# EAGLE design cv-strip (EAGLE 6.6.0)
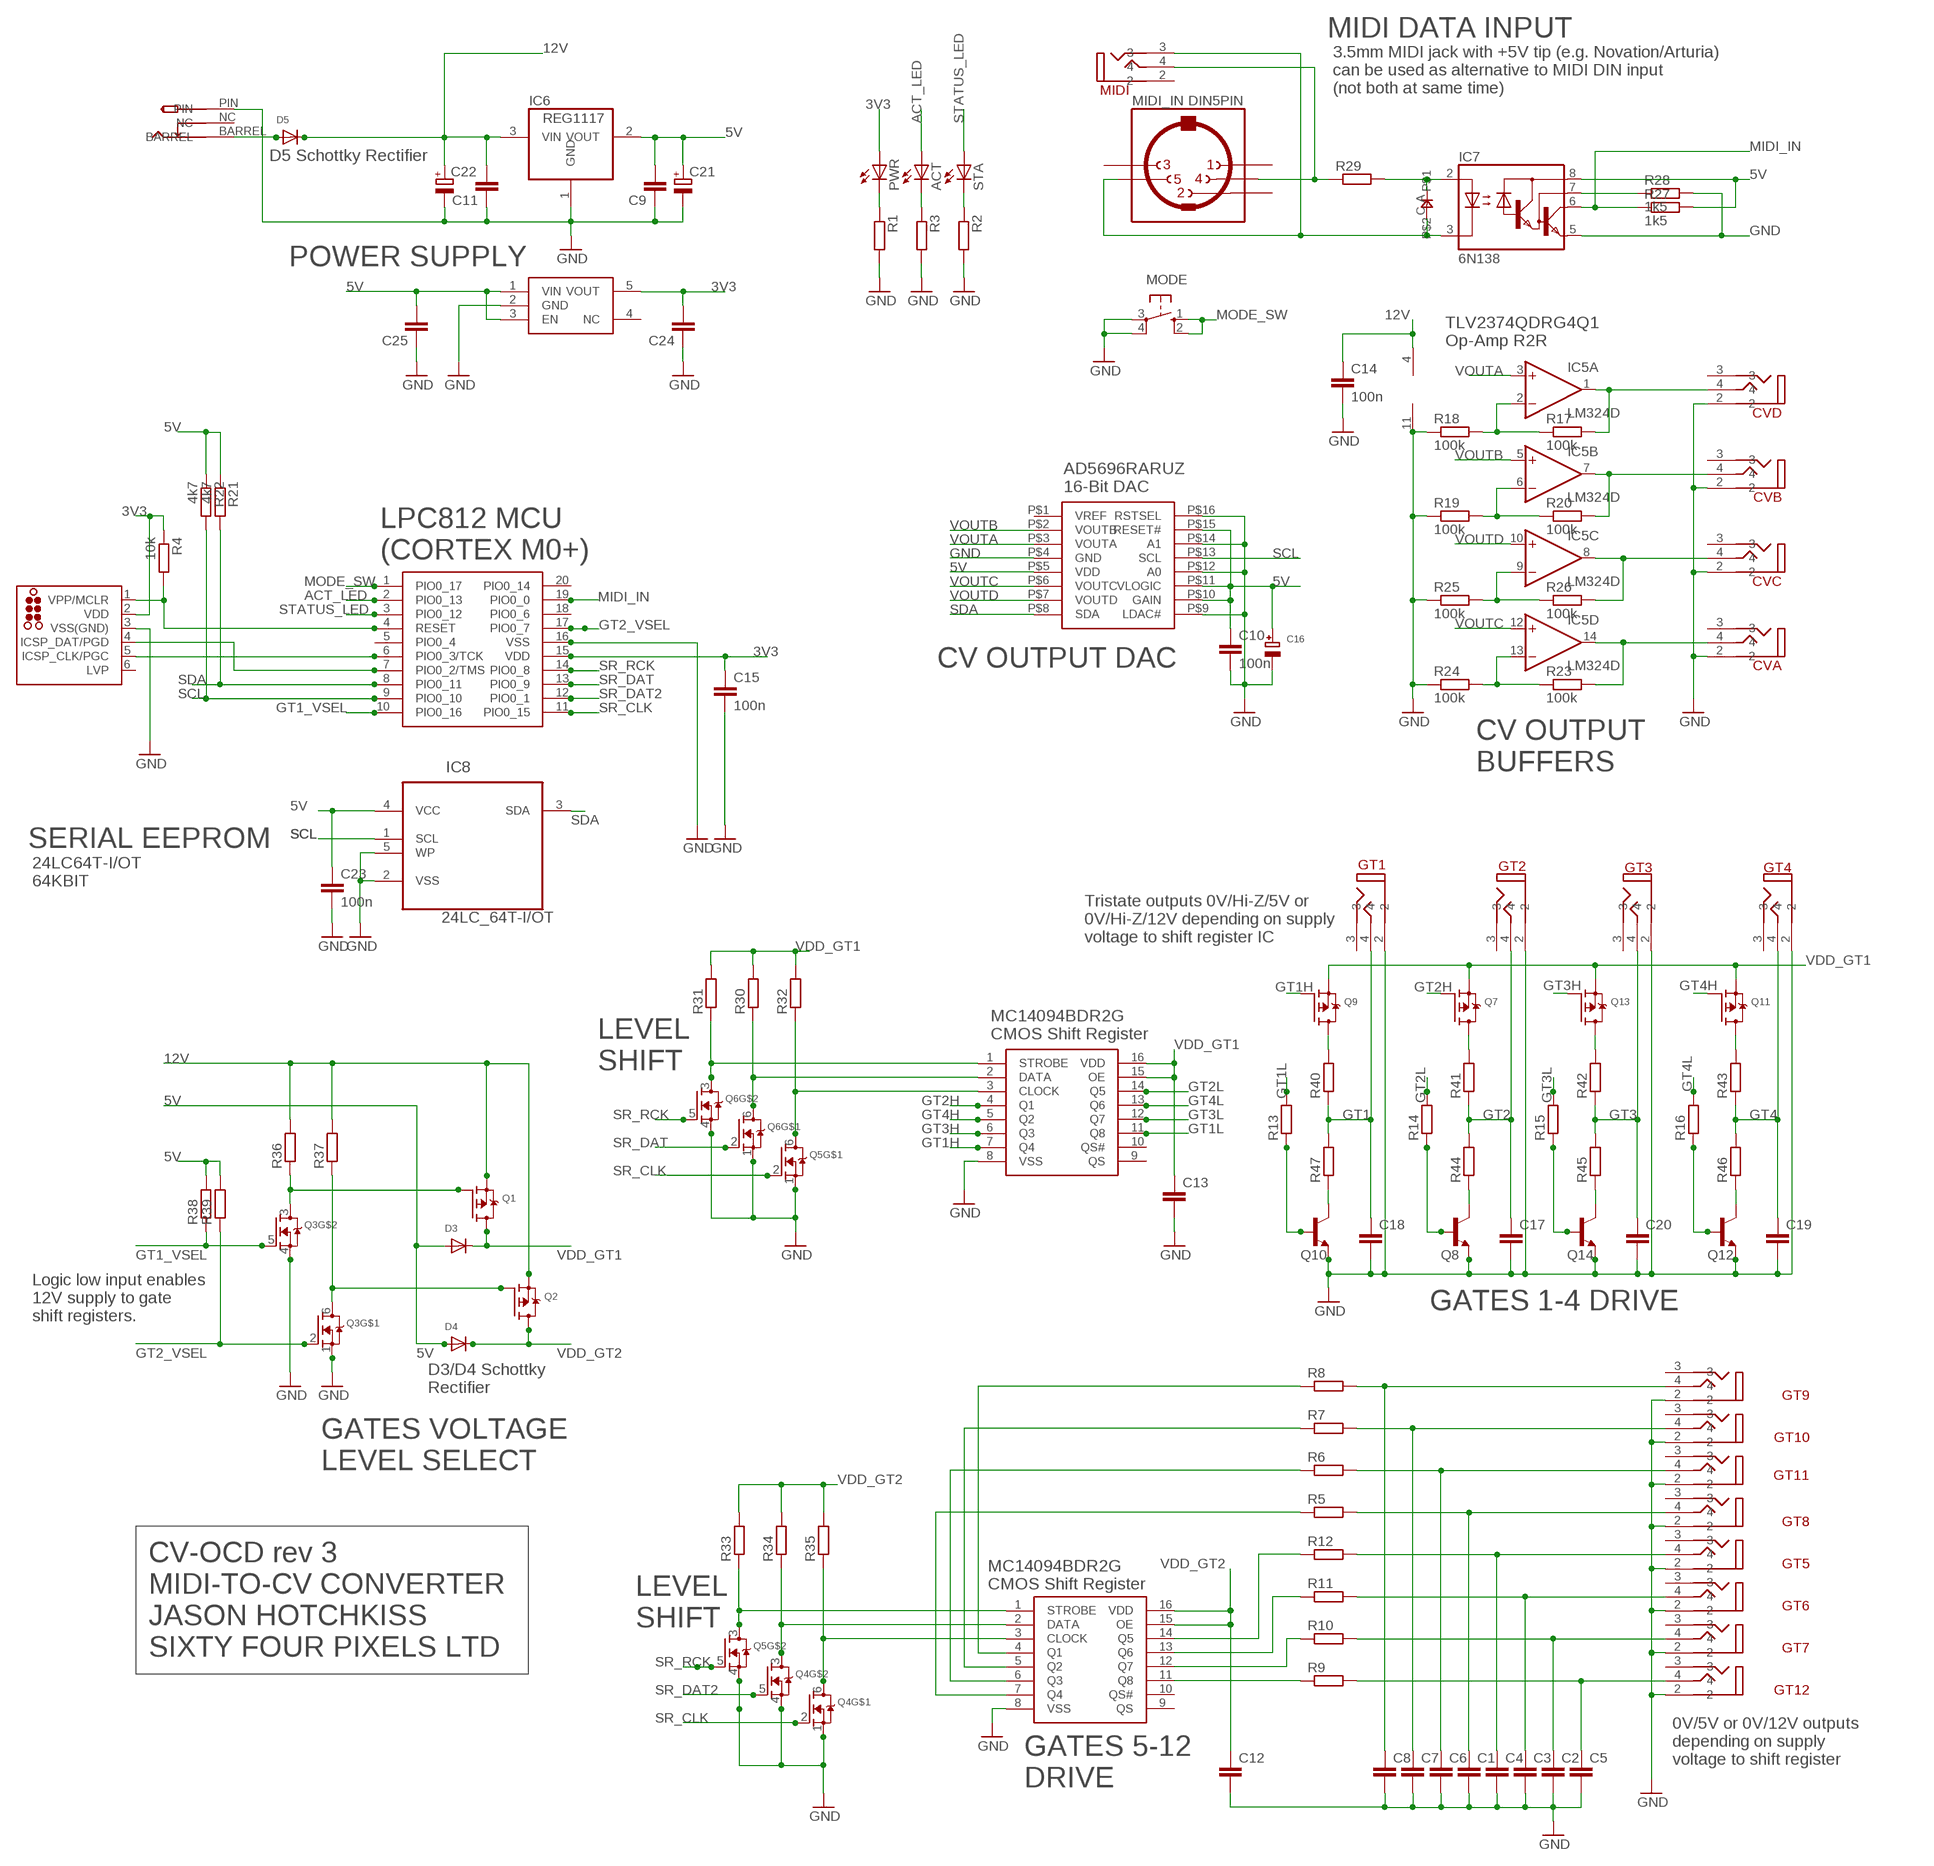
[diagram p0: schematic, sheet 1]

## Parts
ACT  LED3MM  [LED3MM]
C1  C-EUC0805  [C0805]
C2  C-EUC0805  [C0805]
C3  C-EUC0805  [C0805]
C4  C-EUC0805  [C0805]
C5  C-EUC0805  [C0805]
C6  C-EUC0805  [C0805]
C7  C-EUC0805  [C0805]
C8  C-EUC0805  [C0805]
C9  C-EUC0805  [C0805]
C10  100n  C-EUC0805  [C0805]
C11  C-EUC0805  [C0805]
C12  C-EUC0805  [C0805]
C13  C-EUC0805  [C0805]
C14  100n  C-EUC0805  [C0805]
C15  100n  C-EUC0805  [C0805]
C16  CAP_TANTALUMA/3216_REFLOW  [EIA3216-18/A-R]
C17  C-EUC0805  [C0805]
C18  C-EUC0805  [C0805]
C19  C-EUC0805  [C0805]
C20  C-EUC0805  [C0805]
C21  CPOL-EUE2.5-5  [E2,5-5]
C22  CPOL-EUE2.5-5  [E2,5-5]
C23  100n  C-EUC0805  [C0805]
C24  C-EUC0805  [C0805]
C25  C-EUC0805  [C0805]
CVA  VERTICAL_3_5MM_SOCKET  [VERTICAL_3_5MM_SOCKET]
CVB  VERTICAL_3_5MM_SOCKET  [VERTICAL_3_5MM_SOCKET]
CVC  VERTICAL_3_5MM_SOCKET  [VERTICAL_3_5MM_SOCKET]
CVD  VERTICAL_3_5MM_SOCKET  [VERTICAL_3_5MM_SOCKET]
D1  0805DIODE  [0805DIODE]
D3  DIODESOD-123  [SOD-123]
D4  DIODESOD-123  [SOD-123]
D5  DIODESOD-123  [SOD-123]
GT1  VERTICAL_3_5MM_SOCKET  [VERTICAL_3_5MM_SOCKET]
GT2  VERTICAL_3_5MM_SOCKET  [VERTICAL_3_5MM_SOCKET]
GT3  VERTICAL_3_5MM_SOCKET  [VERTICAL_3_5MM_SOCKET]
GT4  VERTICAL_3_5MM_SOCKET  [VERTICAL_3_5MM_SOCKET]
GT5  VERTICAL_3_5MM_SOCKET  [VERTICAL_3_5MM_SOCKET]
GT6  VERTICAL_3_5MM_SOCKET  [VERTICAL_3_5MM_SOCKET]
GT7  VERTICAL_3_5MM_SOCKET  [VERTICAL_3_5MM_SOCKET]
GT8  VERTICAL_3_5MM_SOCKET  [VERTICAL_3_5MM_SOCKET]
GT9  VERTICAL_3_5MM_SOCKET  [VERTICAL_3_5MM_SOCKET]
GT10  VERTICAL_3_5MM_SOCKET  [VERTICAL_3_5MM_SOCKET]
GT11  VERTICAL_3_5MM_SOCKET  [VERTICAL_3_5MM_SOCKET]
GT12  VERTICAL_3_5MM_SOCKET  [VERTICAL_3_5MM_SOCKET]
IC1  LPC812  [TSSOP20]
IC2  AD5696R  [SSOP16]
IC3  MC14094B  [SO16]
IC4  MC14094B  [SO16]
IC5  LM324D  [SO14]
IC6  REG1117  [SOT223]
IC7  6N138  [DIL08]
IC8  24LC_64T-I/OT  [SOT95P290X145-5N]
IC9  MIC5504-2.8YM5-TR  [SOT23-5]
ICSP  TC2030-MCP-NL  [TC2030-MCP-NL]
MIDI  VERTICAL_3_5MM_SOCKET  [VERTICAL_3_5MM_SOCKET]
MIDI_IN  DIN5PIN  [EDGEDIN]
MODE  10-XX  [B3F-10XX]
PWR  LED3MM  [LED3MM]
Q1  MOSFET-P  [SOT23-R]
Q2  MOSFET-P  [SOT23-R]
Q3  MOSFET-N_DUAL  [SOT363]
Q4  MOSFET-N_DUAL  [SOT363]
Q5  MOSFET-N_DUAL  [SOT363]
Q6  MOSFET-N_DUAL  [SOT363]
Q7  MOSFET-P  [SOT23-R]
Q8  MMBT3904LT1-NPN-SOT23-BEC  [SOT23-BEC]
Q9  MOSFET-P  [SOT23-R]
Q10  MMBT3904LT1-NPN-SOT23-BEC  [SOT23-BEC]
Q11  MOSFET-P  [SOT23-R]
Q12  MMBT3904LT1-NPN-SOT23-BEC  [SOT23-BEC]
Q13  MOSFET-P  [SOT23-R]
Q14  MMBT3904LT1-NPN-SOT23-BEC  [SOT23-BEC]
R1  R-EU_R0805  [R0805]
R2  R-EU_R0805  [R0805]
R3  R-EU_R0805  [R0805]
R4  10k  R-EU_R0805  [R0805]
R5  R-EU_R0805  [R0805]
R6  R-EU_R0805  [R0805]
R7  R-EU_R0805  [R0805]
R8  R-EU_R0805  [R0805]
R9  R-EU_R0805  [R0805]
R10  R-EU_R0805  [R0805]
R11  R-EU_R0805  [R0805]
R12  R-EU_R0805  [R0805]
R13  R-EU_R0805  [R0805]
R14  R-EU_R0805  [R0805]
R15  R-EU_R0805  [R0805]
R16  R-EU_R0805  [R0805]
R17  100k  R-EU_R0805  [R0805]
R18  100k  R-EU_R0805  [R0805]
R19  100k  R-EU_R0805  [R0805]
R20  100k  R-EU_R0805  [R0805]
R21  4k7  R-EU_R0805  [R0805]
R22  4k7  R-EU_R0805  [R0805]
R23  100k  R-EU_R0805  [R0805]
R24  100k  R-EU_R0805  [R0805]
R25  100k  R-EU_R0805  [R0805]
R26  100k  R-EU_R0805  [R0805]
R27  1k5  R-EU_R0805  [R0805]
R28  1k5  R-EU_R0805  [R0805]
R29  R-EU_R0805  [R0805]
R30  R-EU_R0805  [R0805]
R31  R-EU_R0805  [R0805]
R32  R-EU_R0805  [R0805]
R33  R-EU_R0805  [R0805]
R34  R-EU_R0805  [R0805]
R35  R-EU_R0805  [R0805]
R36  R-EU_R0805  [R0805]
R37  R-EU_R0805  [R0805]
R38  R-EU_R0805  [R0805]
R39  R-EU_R0805  [R0805]
R40  R-EU_R0805  [R0805]
R41  R-EU_R0805  [R0805]
R42  R-EU_R0805  [R0805]
R43  R-EU_R0805  [R0805]
R44  R-EU_R0805  [R0805]
R45  R-EU_R0805  [R0805]
R46  R-EU_R0805  [R0805]
R47  R-EU_R0805  [R0805]
STA  LED3MM  [LED3MM]
U$2  PWR_SOCKET_2_1MM  [PWR_SOCKET_2_1MM]

## Nets
3V3: C15.1 C24.2 IC1.15(VDD) IC9.5(VOUT) ICSP.2(VDD) PWR.A R4.1
5V: C9.2 C10.1 C16.+ C21.+ C23.1 C25.2 D3.A D4.A IC2.P$5(VDD) IC2.P$10(GAIN) IC2.P$11(VLOGIC) IC2.P$15(RESET#) IC6.2(VOUT) IC7.8(VCC) IC8.4(VCC) IC9.1(VIN) IC9.3(EN) R21.1 R22.1 R27.2 R38.2 R39.2
12V: C11.2 C14.1 C22.+ D5.C IC5.4(P:V+) IC6.3(VIN) Q1.2(S) Q2.2(S) R36.2 R37.2
ACT_LED: ACT.A IC1.2(PIO0_13)
GND: C1.2 C2.2 C3.2 C4.2 C5.2 C6.2 C7.2 C8.2 C9.1 C10.2 C11.1 C12.2 C13.2 C14.2 C15.2 C16.- C17.2 C18.2 C19.2 C20.2 C21.- C22.- C23.2 C24.1 C25.1 CVA.2 CVB.2 CVC.2 CVD.2 GT1.2 GT2.2 GT3.2 GT4.2 GT5.2 GT6.2 GT7.2 GT8.2 GT9.2 GT10.2 GT11.2 GT12.2 IC1.16(VSS) IC2.P$4(GND) IC2.P$9(LDAC#) IC2.P$12(A0) IC2.P$14(A1) IC2.P$16(RSTSEL) IC3.8(VSS) IC4.8(VSS) IC5.11(P:V-) IC6.1(GND) IC7.5(GND) IC8.2(VSS) IC8.5(WP) IC9.2(GND) ICSP.3(VSS(GND)) MODE.3(P) MODE.4(P1) Q3.1(S) Q3.4(S) Q4.1(S) Q4.4(S) Q5.1(S) Q5.4(S) Q6.1(S) Q6.4(S) Q8.E Q10.E Q12.E Q14.E R1.2 R2.2 R3.2 R18.1 R19.1 R24.1 R25.1 R28.2 U$2.PIN
GT1: C18.1 GT1.4 R40.1 R47.2
GT1_VSEL: IC1.10(PIO0_16) Q3.5(G) R38.1
GT1H: IC3.7(Q4) Q9.1(G)
GT1L: IC3.11(Q8) R13.2
GT2: C17.1 GT2.4 R41.1 R44.2
GT2_VSEL: IC1.17(PIO0_7) Q3.2(G) R39.1
GT2H: IC3.4(Q1) Q7.1(G)
GT2L: IC3.14(Q5) R14.2
GT3: C20.1 GT3.4 R42.1 R45.2
GT3H: IC3.6(Q3) Q13.1(G)
GT3L: IC3.12(Q7) R15.2
GT4: C19.1 GT4.4 R43.1 R46.2
GT4H: IC3.5(Q2) Q11.1(G)
GT4L: IC3.13(Q6) R16.2
MIDI_IN: IC1.19(PIO0_0) IC7.6(VO) R27.1
MODE_SW: IC1.1(PIO0_17) MODE.1(S) MODE.2(S1)
N$1: Q7.3(D) R41.2
N$2: CVD.4 IC5.1(A:OUT) R17.2
N$3: CVB.4 IC5.7(B:OUT) R20.2
N$4: CVC.4 IC5.8(C:OUT) R26.2
N$5: CVA.4 IC5.14(D:OUT) R23.2
N$6: Q13.3(D) R42.2
N$7: Q11.3(D) R43.2
N$8: Q10.B R13.1
N$9: Q1.1(G) Q3.3(D) R36.1
N$10: Q8.B R14.1
N$11: Q14.B R15.1
N$12: Q12.B R16.1
N$13: Q8.C R44.1
N$14: IC3.1(STROBE) Q6.3(D) R31.1
N$15: IC3.2(DATA) Q6.6(D) R30.1
N$16: IC3.3(CLOCK) Q5.6(D) R32.1
N$17: IC4.11(Q8) R9.1
N$18: IC4.12(Q7) R10.1
N$19: IC4.13(Q6) R11.1
N$20: C8.1 GT9.4 R8.2
N$21: Q2.1(G) Q3.6(D) R37.1
N$23: C7.1 GT10.4 R7.2
N$24: C6.1 GT11.4 R6.2
N$25: IC5.2(A:-IN) R17.1 R18.2
N$26: IC5.6(B:-IN) R19.2 R20.1
N$27: IC5.9(C:-IN) R25.2 R26.1
N$28: IC5.13(D:-IN) R23.1 R24.2
N$29: MIDI.4 MIDI_IN.4 R29.1
N$30: D1.A IC7.2(A) R29.2
N$31: D1.C IC7.3(C) MIDI.3 MIDI_IN.5
N$32: C1.1 GT8.4 R5.2
N$33: C4.1 GT5.4 R12.2
N$34: IC1.6(PIO0_3/TCK) ICSP.5(ICSP_CLK/PGC)
N$35: PWR.K(C) R1.1
N$36: ACT.K(C) R3.1
N$37: R2.1 STA.K(C)
N$38: IC4.14(Q5) R12.1
N$39: C3.1 GT6.4 R11.2
N$40: D5.A U$2.BARREL
N$41: C2.1 GT7.4 R10.2
N$42: IC7.7(VB) R28.1
N$43: IC4.7(Q4) R5.1
N$44: IC4.6(Q3) R6.1
N$45: IC4.5(Q2) R7.1
N$46: IC4.4(Q1) R8.1
N$48: IC4.1(STROBE) Q5.3(D) R33.1
N$49: IC4.2(DATA) Q4.3(D) R34.1
N$50: IC4.3(CLOCK) Q4.6(D) R35.1
N$51: Q14.C R45.1
N$52: C5.1 GT12.4 R9.2
N$53: Q9.3(D) R40.2
N$54: Q12.C R46.1
N$55: Q10.C R47.1
N$57: IC1.7(PIO0_2/TMS) ICSP.4(ICSP_DAT/PGD)
N$58: IC1.4(RESET) ICSP.1(VPP/MCLR) R4.2
SCL: IC1.9(PIO0_10) IC2.P$13(SCL) IC8.1(SCL) R22.2
SDA: IC1.8(PIO0_11) IC2.P$8(SDA) IC8.3(SDA) R21.2
SR_CLK: IC1.11(PIO0_15) Q4.2(G) Q5.2(G)
SR_DAT: IC1.13(PIO0_9) Q6.2(G)
SR_DAT2: IC1.12(PIO0_1) Q4.5(G)
SR_RCK: IC1.14(PIO0_8) Q5.5(G) Q6.5(G)
STATUS_LED: IC1.3(PIO0_12) STA.A
VDD_GT1: C13.1 D3.C IC3.15(OE) IC3.16(VDD) Q1.3(D) Q7.2(S) Q9.2(S) Q11.2(S) Q13.2(S) R30.2 R31.2 R32.2
VDD_GT2: C12.1 D4.C IC4.15(OE) IC4.16(VDD) Q2.3(D) R33.2 R34.2 R35.2
VOUTA: IC2.P$3(VOUTA) IC5.3(A:+IN)
VOUTB: IC2.P$2(VOUTB) IC5.5(B:+IN)
VOUTC: IC2.P$6(VOUTC) IC5.12(D:+IN)
VOUTD: IC2.P$7(VOUTD) IC5.10(C:+IN)
Unconnected: CVA.3 CVB.3 CVC.3 CVD.3 GT1.3 GT2.3 GT3.3 GT4.3 GT5.3 GT6.3 GT7.3 GT8.3 GT9.3 GT10.3 GT11.3 GT12.3 IC1.5(PIO0_4) IC1.18(PIO0_6) IC1.20(PIO0_14) IC2.P$1(VREF) IC3.9(QS) IC3.10(QS#) IC4.9(QS) IC4.10(QS#) IC9.4(NC) ICSP.6(LVP) MIDI.2 MIDI_IN.1 MIDI_IN.2 MIDI_IN.3 U$2.NC

## Notes on the sheet
- MIDI DATA INPUT
- 3.5mm MIDI jack with +5V tip (e.g. Novation/Arturia)
  can be used as alternative to MIDI DIN input 
  (not both at same time)
- D5 Schottky Rectifier
- POWER SUPPLY
- TLV2374QDRG4Q1
  Op-Amp R2R
- AD5696RARUZ 
  16-Bit DAC
- LPC812 MCU
  (CORTEX M0+)
- CV OUTPUT DAC
- CV OUTPUT
  BUFFERS
- SERIAL EEPROM
- 24LC64T-I/OT 
  64KBIT
- Tristate outputs 0V/Hi-Z/5V or 
  0V/Hi-Z/12V depending on supply 
  voltage to shift register IC
- MC14094BDR2G 
  CMOS Shift Register
- LEVEL
  SHIFT
- GATES 1-4 DRIVE
- Logic low input enables 
  12V supply to gate 
  shift registers.
- D3/D4 Schottky 
  Rectifier
- GATES VOLTAGE 
  LEVEL SELECT
- MC14094BDR2G 
  CMOS Shift Register
- LEVEL
  SHIFT
- CV-OCD rev 3
  MIDI-TO-CV CONVERTER
  JASON HOTCHKISS
  SIXTY FOUR PIXELS LTD
- 0V/5V or 0V/12V outputs
  depending on supply 
  voltage to shift register
- GATES 5-12 
  DRIVE

## Library data of the parts
ACT PWR STA = led:LED: LED OSRAM: - CHIPLED LG R971, LG N971, LY N971, LG Q971, LY Q971, LO R971, LY R971 LH N974, LH R974 LS Q976, LO Q976, LY Q976 LO Q996 - Hyper CHIPLED LW Q18S LB Q993, LB Q99A, LB R99A - SideLED LS A670, LO A670, LY A670, LG A670, LP A670 LB A673, LV A673, LT A673, LW A673 LH A674 LY A675 LS A676, LA A676, LO A676, LY A676, LW A676 LS A679, LY A679, LG A679 - Hyper Micro SIDELED® LS Y876, LA Y876, LO Y876, LY Y876 LT Y87S - SmartLED LW L88C, LW L88S LB L89C, LB L89S, LG L890 LS L89K, LO L89K, LY L89K LS L896, LA L896, LO L896, LY L896 - TOPLED LS T670, LO T670, LY T670, LG T670, LP T670 LSG T670, LSP T670, LSY T670, LOP T670, LYG T670 LG T671, LOG T671, LSG T671 LB T673, LV T673, LT T673, LW T673 LH T674 LS T676, LA T676, LO T676, LY T676, LB T676, LH T676, LSB T676, LW T676 LB T67C, LV T67C, LT T67C, LS T67K, LO T67K, LY T67K, LW E67C LS E67B, LA E67B, LO E67B, LY E67B, LB E67C, LV E67C, LT E67C LW T67C LS T679, LY T679, LG T679 LS T770, LO T770, LY T770, LG T770, LP T770 LB T773, LV T773, LT T773, LW T773 LH T774 LS E675, LA E675, LY E675, LS T675 LS T776, LA T776, LO T776, LY T776, LB T776 LHGB T686 LT T68C, LB T68C - Hyper Mini TOPLED® LB M676 - Mini TOPLED Santana® LG M470 LS M47K, LO M47K, LY M47K Source: http://www.osram.convergy.de LUXEON: - LUMILED® LXK2-PW12-R00, LXK2-PW12-S00, LXK2-PW14-U00, LXK2-PW14-V00 LXK2-PM12-R00, LXK2-PM12-S00, LXK2-PM14-U00 LXK2-PE12-Q00, LXK2-PE12-R00, LXK2-PE12-S00, LXK2-PE14-T00, LXK2-PE14-U00 LXK2-PB12-K00, LXK2-PB12-L00, LXK2-PB12-M00, LXK2-PB14-N00, LXK2-PB14-P00, LXK2-PB14-Q00 LXK2-PR12-L00, LXK2-PR12-M00, LXK2-PR14-Q00, LXK2-PR14-R00 LXK2-PD12-Q00, LXK2-PD12-R00, LXK2-PD12-S00 LXK2-PH12-R00, LXK2-PH12-S00 LXK2-PL12-P00, LXK2-PL12-Q00, LXK2-PL12-R00 Source: www.luxeon.com KINGBRIGHT: KA-3528ASYC Source: www.kingbright.com
C1-C15 C17-C20 C23-C25 = rcl:C-EU: CAPACITOR, European symbol
C16 = microbuilder:CAP_TANTALUM: Tantalum Capacitors Wave footprints have larger pads and are meant to be used for hand soldering. Reflow footprints are optimised for solder paste and a reflow oven. EIA3216-18/A-[R/W] - Size A / 3216-18 / 1206 footprint 4.7µF 25V 10% Tantalum Capacitor 10µF 16V 10% Tantalum Capacitor [Digikey: 495-2236-2-ND] EIA3528-21/B-[R/W] - Size B / 3528-21 47µF 10V 10% Tantalum Capactior [Digikey: 495-2216-1-ND] EIA6032-28/C-[R/W] - Size C / 6032-28 10µF 35V 20% Tantalum Capacitor [Digikey: 495-2285-1-ND] 100µF 16V 10% Tantalum Capactior [Digikey: 399-5214-1-ND]
C21 C22 = resistor:CPOL-EU: POLARIZED CAPACITOR, European symbol
CVA CVB CVC CVD GT1-GT12 MIDI = jason_eagle6:VERTICAL_3_5MM_SOCKET
D1 = jasons_stuff:0805DIODE
D3-D5 = microbuilder:DIODE: Diode SMADIODE - SMA Surface Mount Package 20V 1A Schottky Diode Digikey (500mV @ 1A, 500uA Vr @ 20V): 641-1014-6-ND 10V 2A Schottky Diode Digikey (350mV @ 2A, 700uA Vr @ 10V): MBRA210LT3 SOD-123 30V 200mA (800mV Vf, 2uA Vr @ 25V) Schottky Diode (very fast switching for boost, etc.) - Digikey: BAT54T1GOSTR-ND 30V 500mA (430mV Vf, 130uA Vr @ 30V) Schottky Diode - Digikey: B0530W-FDICT-ND MBR120 1A 20V (0.34Vf) Schottky Diode - Digikey: MBR120VLSFT1GOSCT-ND SOD-323 10V 570mA (380mV Vf, 3ns) Schottky Diode - Digikey: ZLLS410CT-ND 1N4148WS - 75V 150mA (1V Vf @ 10mA, 4ns) Simple Diode - Digikey: 1N4148WSFSCT-ND, Mouser: 512-1N4148WS SOD-523 BAT54 30V 200mA Schottky (0.8 Vf @ 100mA, 5ns) - Digikey: BAT54XV2CT-ND 30V 30mA Schottky Diode (RB751S-40TE61) - Digikey: RB751S-40TE61CT-ND SOT23-R/W - SOT23 Package (R = Solder Paste/Reflow Ovens, W = Hand-Soldering) BAT54Film 40V 300mA - Digikey: 497-7162-1-ND DO-1N4148 Through Hole Small Current Diode (any model)
IC1 = jason_eagle6:LPC812
IC2 = jason_eagle6:AD5696R
IC3 IC4 = jason_eagle6:MC14094B
IC5 = linear:LM324: OP AMP
IC6 = burr-brown:REG1117: 800mA and 1A Low Dropout (LDO) Positive Regulator 1.8V, 2.5V, 2.85V, 3.3V, 5V, and Adj; MPN: REG1117; OC_FARNELL: 1097566; OC_NEWARK: 14P6981
IC7 = optocoupler:6N138: MOTOROLA OPTO COUPLER; MF: VISHAY/TELEFUNKEN; MPN: 6N138; OC_FARNELL: 9860150; OC_NEWARK: 35K5294
IC8 = Microchip-24LCxxx:24LC_: IC, I2C Serial EEPROM,SOT-23-5; MPN: 24LC64T-I/OT; OC_FARNELL: 1700992; OC_NEWARK: 08P0142; PACKAGE: SOT-23-5; SUPPLIER: MICROCHIP
IC9 = jason_eagle6:MIC5504-2.8YM5-TR
ICSP = tag-connect:TC2030: TAG-CONNECT ICSP Connector Manufacturer: Tag-Connect <http://www.tag-connect.com> Cable for easy In-Circuit Serial Programming. Designed for Microchip ICD2, suitable for many others. Two variants - one "with legs" (for hands-free fit on PCB) and another "without legs" for quick programming. PAD Description 1 MCLR/Vpp 2 Vdd 3 GND 4 PGD (ISPDAT) 5 PGC (ISPCLK) 6 nc (used for LVP) ©2009 ROFA.cz - modified and updated by Robert Darlington ‹rdarlington@gmail.com›
MIDI_IN = jason_eagle6:DIN5PIN: Female CONNECTOR 5 pins 90 deg. with shield, horizontal (DIN 41524)
MODE = switch-omron:10-XX: OMRON SWITCH; MPN: B3F-1000; OC_FARNELL: 176432; OC_NEWARK: 36M3542
Q1 Q2 Q7 Q9 Q11 Q13 = microbuilder:MOSFET-P: P-Channel Mosfet SOT-23 IRLML5103 30V 760mA 1V Vgs - Digikey: IRLML5103PBFCT-ND NTR0202PL 20V 400mA 2.3V Vgs - Digikey: NTR0202PLT1GOSTR-ND NTR4101PT1G 20V 1.8A 1.2V Vgs - Digikey: NTR4101PT1GOSCT-ND DMP2004K 20V 600mA 1V Vgs - Digikey: DMP2004KDICT-ND
Q3-Q6 = jason_eagle6:MOSFET-N_DUAL: Dual N-Channel MOSFET SOT363 (2.0x1.25mm) 2N7002PS - 60V, 320mA [Digikey: 568-5984-1-ND]
Q8 Q10 Q12 Q14 = transistor:*-NPN-: NPN Transistror BF959 corrected 2008.03.06
R1-R47 = rcl:R-EU_: RESISTOR, European symbol
U$2 = jason_eagle6:PWR_SOCKET_2_1MM

## Board
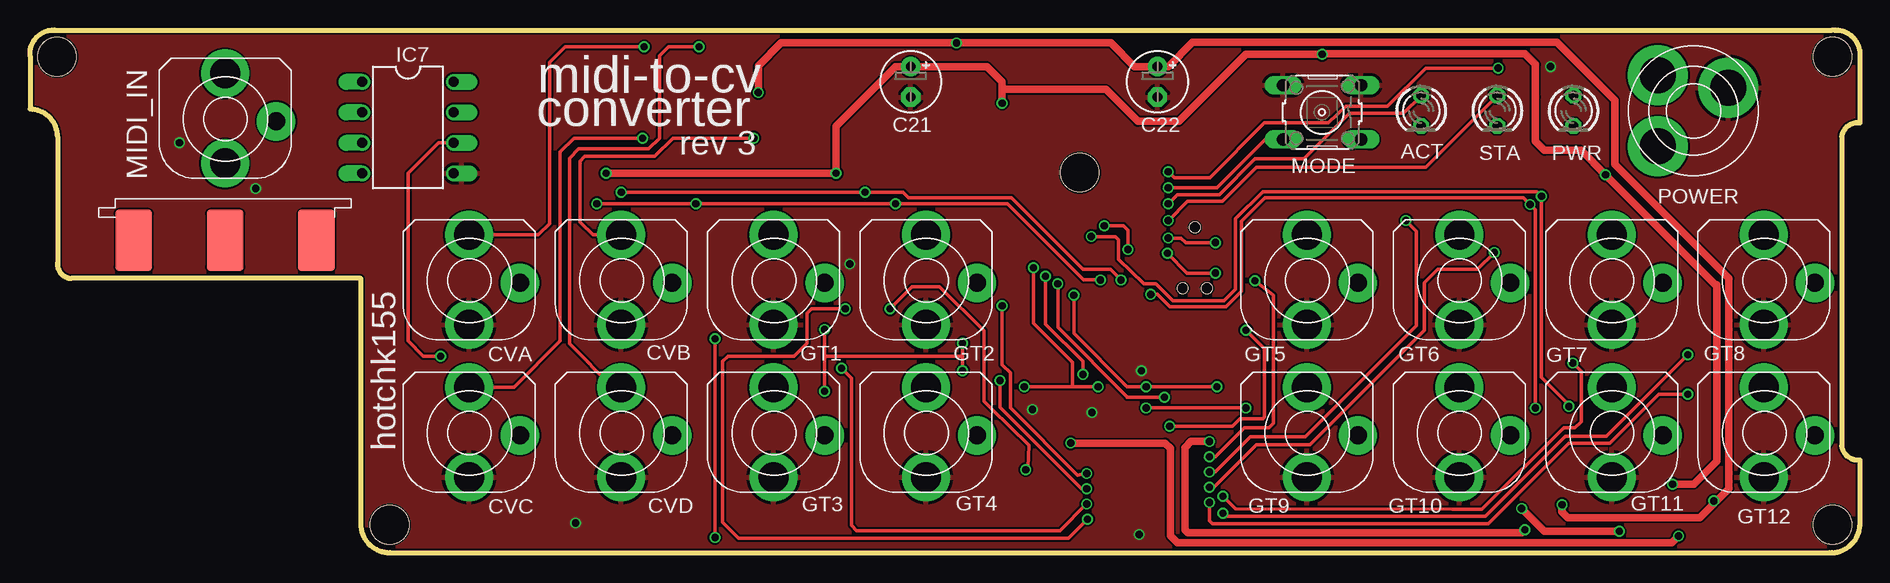
[diagram p1: board, top side]
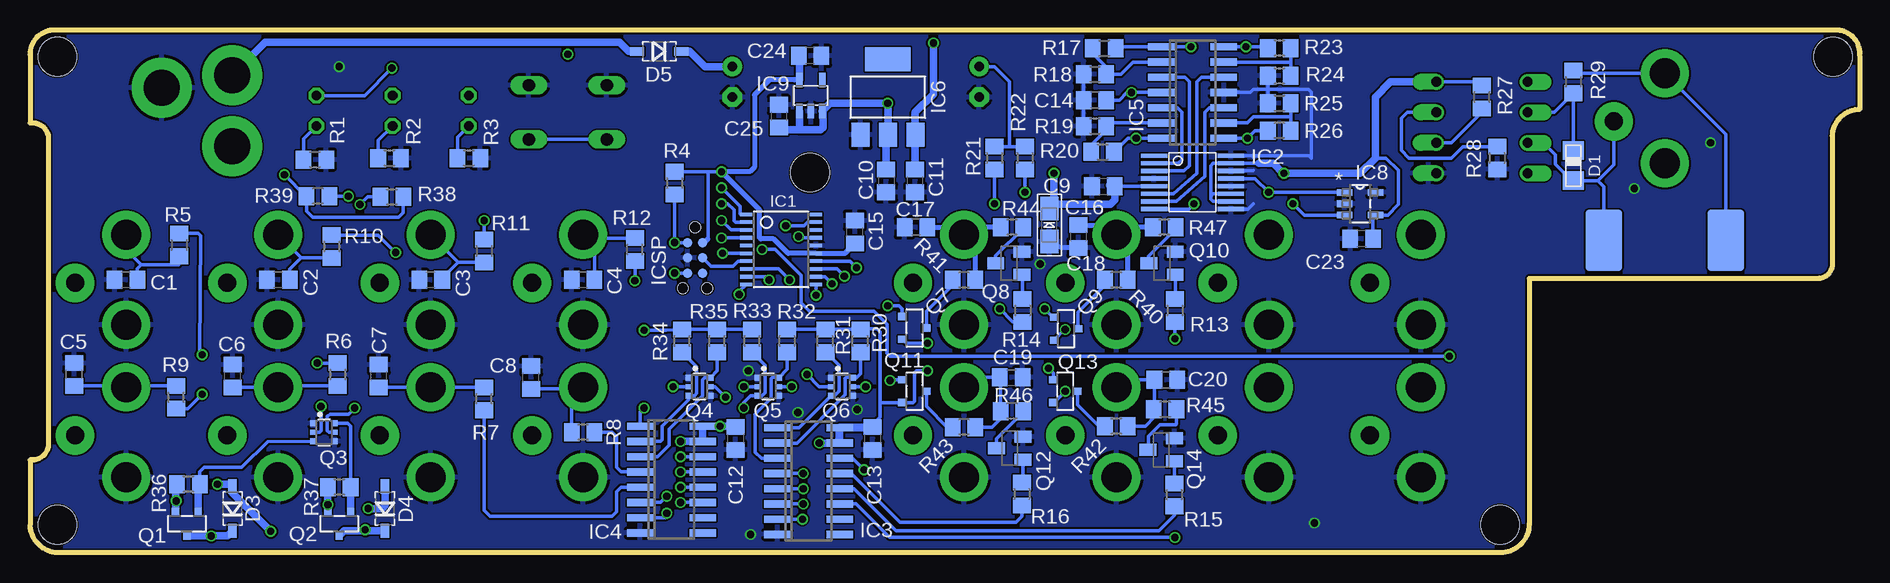
[diagram p2: board, bottom side, seen from below]

Size 152.53 x 43.56 mm. Coordinates in mm from the lower left corner, seen from the top.
Outline: 150.25,43.56 2.04,43.56 arc97 0.01,41.4 0.01,36.96 arc-90 2.29,34.67 2.29,24.13 arc90 3.44,22.86 27.57,22.86 27.57,2.41 arc90 29.98,0 149.99,0 arc90 152.53,2.29 152.53,7.75 arc-90 151.01,8.89 151.01,34.67 arc-90 152.53,35.82 152.53,41.53 arc90 150.5,43.56 150.38,43.56
Copper layers (1*16): Top 0.035mm / dielectric 1.5mm / Bottom 0.035mm
Design rules "hackvana": minimum track width 6mil, minimum drill 0.3mm, track to track 6mil, track to pad 9mil, pad to pad 6mil, via to via 6mil, smd to smd 0mil, copper to edge 6mil, drill to drill 6mil, minimum pad ring 10mil, minimum via ring 6mil, stop-mask expansion 2mil, vias tented up to drill 100mil, thermal gap 10mil
Holes 3.2 mm at 29.98,2.33 150.26,2.33 2.26,41.33 150.26,41.33 87.51,31.68

### Footprints (pad centres in the part's own frame; a part is rotated, then mirrored left to right if it is on the bottom)
LED3MM = drill 0.813 octagon: A -1.27,0; K 1.27,0
C0805 = smd 1.3 x 1.5: 1 -0.95,0; 2 0.95,0
EIA3216-18/A-R = smd 1.95 x 1.5: + 1.375,0; - -1.375,0
E2,5-5 = drill 0.813 pad 1.6: + -1.27,0 | drill 0.813 pad 1.6 octagon: - 1.27,0
VERTICAL_3_5MM_SOCKET = drill 2.5 pad 4: 2 0,-3.75; 4 0,3.75 | drill 1.5 pad 3.2: 3 4.25,-0.25
0805DIODE = smd 1.524 x 1.778: A -1.262,-0.005; C 1.238,-0.005
SOD-123 = smd 1.2 x 0.7: A 1.85,0; C -1.85,0
TSSOP20 = smd 0.305 x 0.991: 1 -2.925,-2.918; 2 -2.275,-2.918; 3 -1.625,-2.918; 4 -0.975,-2.918; 5 -0.325,-2.918; 6 0.325,-2.918; 7 0.975,-2.918; 8 1.625,-2.918; 9 2.275,-2.918; 10 2.925,-2.918; 11 2.925,2.918; 12 2.275,2.918; 13 1.625,2.918; 14 0.975,2.918; 15 0.325,2.918; 16 -0.325,2.918; 17 -0.975,2.918; 18 -1.625,2.918; 19 -2.275,2.918; 20 -2.925,2.918
SSOP16 = smd 0.35 x 2.2: P$1 -2.223,-3.2; P$2 -1.587,-3.2; P$3 -0.953,-3.2; P$4 -0.318,-3.2; P$5 0.318,-3.2; P$6 0.953,-3.2; P$7 1.587,-3.2; P$8 2.223,-3.2; P$9 2.223,3.2; P$10 1.587,3.2; P$11 0.953,3.2; P$12 0.318,3.2; P$13 -0.318,3.2; P$14 -0.953,3.2; P$15 -1.587,3.2; P$16 -2.223,3.2
SO16 = smd 0.6 x 2.2: 1 -4.445,-2.6; 2 -3.175,-2.6; 3 -1.905,-2.6; 4 -0.635,-2.6; 5 0.635,-2.6; 6 1.905,-2.6; 7 3.175,-2.6; 8 4.445,-2.6; 9 4.445,2.6; 10 3.175,2.6; 11 1.905,2.6; 12 0.635,2.6; 13 -0.635,2.6; 14 -1.905,2.6; 15 -3.175,2.6; 16 -4.445,2.6
SO14 = smd 0.6 x 2.2: 1 -3.81,-2.6; 2 -2.54,-2.6; 3 -1.27,-2.6; 4 0,-2.6; 5 1.27,-2.6; 6 2.54,-2.6; 7 3.81,-2.6; 8 3.81,2.6; 9 2.54,2.6; 10 1.27,2.6; 11 0,2.6; 12 -1.27,2.6; 13 -2.54,2.6; 14 -3.81,2.6
SOT223 = smd 1.499 x 2.007: 1 -2.261,-3.15; 2 0.025,-3.15; 3 2.311,-3.15 | smd 3.81 x 2.007: 4 0,3.15
DIL08 = drill 0.813 offset: 1 -3.81,-3.81; 2 -1.27,-3.81; 3 1.27,-3.81; 4 3.81,-3.81; 5 3.81,3.81; 6 1.27,3.81; 7 -1.27,3.81; 8 -3.81,3.81
SOT95P290X145-5N = smd 1.27 x 0.559: 1 -1.295,0.94; 2 -1.295,0; 3 -1.295,-0.94; 4 1.295,-0.94; 5 1.295,0.94
SOT23-5 = smd 0.55 x 1.2: 1 -0.95,-1.3; 2 0,-1.3; 3 0.95,-1.3; 4 0.95,1.3; 5 -0.95,1.3
TC2030-MCP-NL = smd 0.787 x 0.787: 1 1.27,-0.635; 2 1.27,0.635; 3 2.54,-0.635; 4 2.54,0.635; 5 3.81,-0.635; 6 3.81,0.635 | hole 0.889: 0,0; 5.08,-1.016; 5.08,1.016
EDGEDIN = smd 3.048 x 5.08: 1 -7.62,-10.16; 2 0,-10.16; 3 7.62,-10.16 | smd 3.048 x 5.08 bottom: 4 -5.08,-10.16; 5 5.08,-10.16
B3F-10XX = drill 1.016 long: 1 -3.251,2.261; 2 3.251,2.261; 3 -3.251,-2.261; 4 3.251,-2.261
SOT23-R = smd 0.6 x 0.7: 1 -0.95,-1; 2 0.95,-1; 3 0,1
SOT363 = smd 0.5 x 0.5: 1 -0.75,-0.9; 3 0.75,-0.9; 4 0.75,0.9; 6 -0.75,0.9 | smd 0.4 x 0.5: 2 0,-0.9; 5 0,0.9
SOT23-BEC = smd 1 x 1.4: B -0.95,-1.1; C 0,1.1; E 0.95,-1.1
R0805 = smd 1.3 x 1.5: 1 -0.95,0; 2 0.95,0
PWR_SOCKET_2_1MM = drill 3 pad 5: BARREL 0,4.2; NC -4.2,0; PIN 3.4,-0.7

### Placement (x,y rotation side)
ACT  115.96,36.83 270 top
C1  144.53,22.73 180 bottom
C2  131.83,22.73 180 bottom
C3  119.13,22.73 180 bottom
C4  106.43,22.73 180 bottom
C5  148.85,14.86 90 bottom
C6  135.64,14.73 90 bottom
C7  123.45,14.73 90 bottom
C8  110.75,14.61 90 bottom
C9  63.06,30.54 0 bottom
C10  81.16,30.99 270 bottom
C11  78.75,30.99 90 bottom
C12  93.73,9.53 270 bottom
C13  82.3,9.53 270 bottom
C14  63.76,37.72 180 bottom
C15  83.76,26.73 90 bottom
C16  67.57,27.31 90 bottom
C17  78.68,27.12 180 bottom
C18  65.16,26.35 270 bottom
C19  70.75,14.61 0 bottom
C20  57.86,14.42 0 bottom
C21  73.41,39.24 270 top
C22  93.99,39.24 270 top
C23  41.54,26.16 180 bottom
C24  87.51,41.4 180 bottom
C25  90.11,36.39 270 bottom
CVA  36.58,22.73 0 top
CVB  49.28,22.73 0 top
CVC  36.58,10.03 0 top
CVD  49.28,10.03 0 top
D1  23.88,32.26 270 bottom
D3  135.64,3.68 90 bottom
D4  122.94,3.68 90 bottom
D5  100.08,41.78 180 bottom
GT1  61.98,22.73 0 top
GT2  74.68,22.73 0 top
GT3  61.98,10.03 0 top
GT4  74.68,10.03 0 top
GT5  106.43,22.73 0 top
GT6  119.13,22.73 0 top
GT7  131.83,22.73 0 top
GT8  144.53,22.73 0 top
GT9  106.43,10.03 0 top
GT10  119.13,10.03 0 top
GT11  131.83,10.03 0 top
GT12  144.53,10.03 0 top
IC1  89.92,25.27 270 bottom
IC2  55.63,30.86 270 bottom
IC3  87.64,5.97 270 bottom
IC4  99.07,6.1 270 bottom
IC5  55.63,38.36 270 bottom
IC6  81.03,37.97 0 bottom
IC7  31.5,35.43 270 top
IC8  41.66,29.08 0 bottom
IC9  87.45,38.1 0 bottom
ICSP  97.1,27.12 270 bottom
MIDI  16.26,36.2 0 top
MIDI_IN  16.26,36.2 0 top
MODE  107.7,36.7 180 top
PWR  128.66,36.83 270 top
Q1  139.45,2.41 180 bottom
Q2  126.75,2.41 180 bottom
Q3  128.02,10.03 270 bottom
Q4  96.72,13.84 270 bottom
Q5  91,13.84 270 bottom
Q6  84.84,13.84 270 bottom
Q7  78.81,18.73 270 bottom
Q8  70.94,24.13 90 bottom
Q9  66.17,18.67 270 bottom
Q10  58.17,24.13 90 bottom
Q11  78.81,13.46 270 bottom
Q12  70.87,8.7 90 bottom
Q13  66.24,13.46 270 bottom
Q14  58.24,8.57 90 bottom
R1  128.79,32.77 0 bottom
R2  122.56,32.89 0 bottom
R3  115.96,32.89 0 bottom
R4  98.81,30.8 270 bottom
R5  140.09,25.66 270 bottom
R6  126.88,14.86 270 bottom
R7  114.69,12.83 90 bottom
R8  106.43,10.03 180 bottom
R9  140.34,12.96 90 bottom
R10  127.39,25.53 270 bottom
R11  114.69,25.15 270 bottom
R12  102.12,25.27 90 bottom
R13  57.09,20.19 270 bottom
R14  69.79,20.19 270 bottom
R15  57.16,4.83 270 bottom
R16  69.86,4.89 270 bottom
R17  63,42.04 0 bottom
R18  63.76,39.88 0 bottom
R19  63.76,35.56 0 bottom
R20  63.13,33.4 0 bottom
R21  72.14,32.89 270 bottom
R22  69.6,32.89 270 bottom
R23  48.39,42.04 180 bottom
R24  48.39,39.75 0 bottom
R25  48.39,37.47 0 bottom
R26  48.39,35.18 180 bottom
R27  31.5,37.97 90 bottom
R28  30.23,32.89 270 bottom
R29  23.88,39.24 270 bottom
R30  83.32,17.65 90 bottom
R31  86.24,17.65 90 bottom
R32  89.42,17.65 90 bottom
R33  92.34,17.65 90 bottom
R34  98.18,17.65 90 bottom
R35  95.26,17.65 90 bottom
R36  139.33,5.72 180 bottom
R37  126.75,5.46 180 bottom
R38  122.37,29.66 0 bottom
R39  128.53,29.72 180 bottom
R40  61.98,22.73 180 bottom
R41  74.68,22.73 180 bottom
R42  61.98,10.54 180 bottom
R43  74.68,10.48 180 bottom
R44  70.68,27.12 180 bottom
R45  57.92,11.94 180 bottom
R46  70.68,11.81 180 bottom
R47  57.98,27.12 180 bottom
STA  122.31,36.83 270 top
U$2  138.66,36.83 45 top

### Tracks (layer width: path | path; a pad name or v marks a point on that pad's centre or on a via)
3V3  (via drill 0.6)
  Top 0.305: v122.37,40.39 116.34,40.39 113.16,37.21 109.67,37.21 108.21,35.82 102.88,35.82 98.37,31.24 95.38,31.24 v94.88,31.75
  Bottom 0.305: PWR.A 124.66,38.1 v122.37,40.39 | 96.02,26.16 96.02,31.75 | R4.1 96.02,31.75 | 96.02,31.75 v94.88,31.75
  Bottom 0.406: C15.1 84.6,24.95 IC1.15 89.34,24.95 90.56,26.16 91.64,26.16 91.7,26.23 91.7,28.58 v94.88,31.75 92.53,31.75 92.15,32.13 92.15,38.16 90.91,39.4 IC9.5 | IC9.5 | ICSP.2 96.34,25.85 96.02,26.16 | IC9.5 88.81,39.4
  Bottom 0.61: IC9.5 88.4,41.34 C24.2
5V  (via drill 0.6)
  Top 0.305: 125.61,38.1 125.48,37.97
  Top 0.61: v124.34,3.68 126.25,1.78 v132.47,1.78 | 81.03,38.61 81.03,39.24 79.76,40.51 C21.+ | v81.03,37.47 81.03,38.61 | 81.03,38.61 89.67,38.61 92.34,35.94 95.77,35.94 101.35,41.53 v107.7,41.53 107.77,41.59 124.59,41.59 125.48,40.7 125.48,37.97 125.48,34.29 126.25,33.53 129.29,33.53 v131.33,31.5 132.15,30.67 140.47,22.35 140.6,22.35 140.6,7.62 138.69,5.72 v136.91,5.72 | C21.+ 72.46,40.51 | C21.+ 72.14,40.51 67.19,35.56 v67.19,31.62 v48.01,31.62
  Bottom 0.305: 54.11,29.72 54.11,32.26 53.92,32.45 IC2.P$15 49.28,32.45 | IC2.P$10 53.92,29.28 54.11,29.47 54.11,29.72 | IC2.P$11 53.92,29.91 54.11,29.72 | IC7.8 31.82,39.24 R27.2 | R22.1 70.87,33.84 | 70.87,33.84 R21.1 | C21.+ 72.14,40.51 70.87,39.24 70.87,33.84 | C23.1 40.59,27.93 IC8.4 39.36,28.14 38.49,29.02 38.49,31.88 39.5,32.89 40.39,32.89 | IC2.P$5 C9.2 | R38.2 121.42,28.32 121.8,27.94 128.98,27.94 129.48,28.45 R39.2 129.55,29.72 v131.33,31.5
  Bottom 0.406: 62.49,30.55 C9.2 61.98,30.55
  Bottom 0.61: v132.47,1.78 135.64,4.95 D3.A 135.83,5.72 v136.91,5.72 | D4.A 122.94,3.94 123.2,3.68 v124.34,3.68 | C10.1 81.16,34.67 IC6.2 81.01,36.93 v81.03,37.47 85.83,37.47 IC9.3 86.43,36.74 86.43,35.43 86.62,35.24 88.4,35.24 88.4,35.25 | 62.56,30.61 62.49,30.55 | IC7.8 39.12,39.24 40.39,37.97 40.39,32.89 41.66,31.62 v48.01,31.62 48.08,31.62 48.9,32.45 49.28,32.45 50.11,32.45 | 66.98,29.02 62.49,29.02 62.11,29.4 C9.2 | 66.98,29.02 C16.+ | 66.98,29.02 67.19,29.02 v67.19,31.62 | IC9.1 88.4,35.25 | 88.4,35.25 89.92,35.25 C25.2
12V  (via drill 0.6)
  Top 0.61: v127.7,4 Q2.2 128.2,2.92 139.2,2.92 140.34,4.07 v140.34,4.32 140.6,4.32 141.61,5.34 141.61,22.86 132.09,32.39 132.09,37.72 127.26,42.55 96.91,42.55 94.88,40.51 C22.+ 92.08,40.51 90.11,42.48 v77.22,42.48 62.62,42.48 60.71,40.58 v60.71,38.36
  Bottom 0.305: IC5.4 v60.71,38.36 61.09,38.36 61.73,37.72 C14.1
  Bottom 0.61: R36.2 140.4,5.59 Q1.2 140.4,4.26 v140.34,4.32 | Q2.2 v127.7,4 R37.2 | 78.62,34.93 IC6.3 78.75,34.8 | C11.2 78.75,34.8 | D5.C 97.54,41.78 96.27,40.51 C22.+ | 78.75,34.8 78.75,36.7 77.22,38.23 v77.22,42.48
ACT_LED  (via drill 0.6)
  Top 0.305: ACT.A 114.5,36.64 109.99,36.64 106.18,32.83 102.12,32.83 99.13,29.85 95.64,29.85 v94.88,29.08
  Bottom 0.305: IC1.2 93.72,27.55 93.86,27.69 93.86,28.58 94.37,29.08 v94.88,29.08
GND  (via drill 0.6)
  Bottom 0.305: IC5.11 50.81,38.36 50.55,38.61 49.41,38.61 | R24.1 49.34,38.68 49.41,38.61 | 49.41,38.61 49.34,38.54 R25.1 49.34,38.55 49.28,38.61 45.98,38.61 45.73,38.36 45.73,32.89 45.92,33.08 50.68,33.08 | R18.1 C14.2 R19.1 | IC2.P$9 51,28.64 50.55,29.08 | IC2.P$16 50.68,33.08 | IC2.P$14 50.62,31.82 50.55,31.88 | 50.55,32.96 50.68,33.08
  Bottom 0.406: C18.2 66.54,25.4 C16.-
  other vias: 12.45,34.16 18.8,30.35 126.75,40.51 83.57,11.94 88.53,11.69 92.65,15.18 68.33,24.07 45.47,2.48 92.46,1.53
  pour Bottom: -4.06,48.13 -5.33,48.13 -5.33,-7.75 159.77,-7.75 159.77,49.4 -4.06,49.4
  pour Top: -2.79,45.59 -10.41,45.59 -10.41,-7.75 155.96,-7.75 155.96,49.4 -2.79,49.4
GT1
  Bottom 0.305: R40.1 60.67,22.73
  Bottom 0.406: R47.2 61.35,27.12 GT1.4 | C18.1 62.8,27.3 GT1.4 | R40.1 61.03,25.53 GT1.4
GT1_VSEL  (via drill 0.6)
  Top 0.305: v93.42,21.53 93.99,21.53 95,20.51 99.7,20.51 100.97,21.78 100.97,27.62 102.94,29.59 124.47,29.59 v125.04,29.02 125.48,28.58 v125.48,12.07
  Bottom 0.305: v93.42,21.53 93.42,21.77 IC1.10 | Q3.5 127.58,10.03 127.77,10.16 127.77,11.37 127.52,11.56 125.99,11.56 v125.48,12.07 | R38.1 124.4,29.66 v125.04,29.02
GT1H  (via drill 0.6)
  Top 0.305: v88.15,2.8 86.56,1.21 59.06,1.21 57.73,2.54 57.73,15.94 58.17,16.38 63.7,16.38 64.78,17.46 64.78,19.94 65.16,20.32 v67.95,20.32
  Bottom 0.305: Q9.1 67.25,19.62 v67.95,20.32 | v88.15,2.8 IC3.7
GT1L  (via drill 0.6)
  Top 0.305: v57.09,17.85 v57.09,1.27
  Bottom 0.305: R13.2 v57.09,17.85 | v57.09,1.27 80.91,1.27 83.7,4.07 IC3.11
GT2
  Bottom 0.406: R44.2 74.05,27.12 GT2.4 | C17.1 75.32,27.12 GT2.4 | R41.1 73.73,25.59 74.68,26.54 GT2.4
GT2_VSEL  (via drill 0.6)
  Top 0.305: v128.28,12.19 128.28,12.32 125.99,14.61 v125.99,29.72 125.61,30.1 102.75,30.1 100.46,27.81 100.46,21.97 99.51,21.02 95.26,21.02 93.86,22.42 92.84,22.42 90.75,24.45 90.75,26.1 90.49,26.35 v88.46,26.35
  Bottom 0.305: Q3.2 128.4,10.03 128.28,10.16 v128.28,12.19 | R39.1 v125.99,29.72 | 88.27,26.29 88.34,26.35 v88.46,26.35 88.36,26.25 IC1.17
GT2H  (via drill 0.6)
  Top 0.305: v88.08,6.61 87.32,6.48 81.73,12.07 81.73,14.99 81.03,15.69 v81.03,20.58
  Bottom 0.305: IC3.4 v88.08,6.61 | v81.03,20.58 80.08,20.58 79.83,20.32 79.83,19.7 Q7.1
GT2L  (via drill 0.6)
  Top 0.305: v71.7,20.32 73.54,22.16 75.83,22.16 79.51,18.48 79.51,12.64 80.14,12 83.26,8.96 83.19,7.11 v83,6.92
  Bottom 0.305: IC3.14 83.95,7.88 v83,6.92 | R14.2 70.62,19.24 v71.7,20.32
GT3
  Bottom 0.305: GT3.4 61.35,14.42 C20.1 58.81,12 R45.2 58.74,11.81 58.74,11.37 59.57,10.54 R42.1
GT3H  (via drill 0.6)
  Top 0.305: v88.08,4.07 85.86,1.84 68.9,1.84 68.46,2.29 68.46,14.54 v67.63,15.37
  Bottom 0.305: Q13.1 67.24,14.97 v67.63,15.37 | v88.08,4.07 IC3.6
GT3L
  Bottom 0.305: R15.2 57.16,3.11 58.43,1.84 80.34,1.84 83.83,5.34 IC3.12
GT4
  Bottom 0.305: R43.1 72.33,10.48 71.57,11.24 71.57,11.75 R46.2 71.63,14.54 C19.1 73.86,14.61 GT4.4
GT4H  (via drill 0.6)
  Top 0.305: v80.84,14.35 80.84,12.13 87.64,5.34 v88.08,5.34
  Bottom 0.305: IC3.5 v88.08,5.34 | Q11.1 80.78,14.41 v80.84,14.35
GT4L
  Bottom 0.305: IC3.13 84.08,6.61 80.02,2.54 70.37,2.54 69.86,3.05 R16.2
MIDI_IN  (via drill 0.6)
  Top 0.305: v34.23,16.38 32.77,16.38 31.5,17.65 31.5,31.62 34.04,34.16 IC7.6 | v89.54,27.24 91.13,27.24 91.51,26.86 v91.51,25.27
  Bottom 0.305: R27.1 31.5,36.7 34.04,34.16 IC7.6 | v34.23,16.38 80.84,16.38 81.1,16.64 81.1,19.05 82.18,20.13 87.57,20.13 88.27,20.83 88.27,23.12 90.43,25.27 v91.51,25.27 | IC1.19 87.71,27.55 88.02,27.24 v89.54,27.24
MODE_SW  (via drill 0.6)
  Top 0.305: MODE.2 102.97,34.44 98.94,30.42 v94.88,30.42
  Bottom 0.305: MODE.2 MODE.1 | IC1.1 93.29,28.2 93.35,28.26 93.35,28.89 v94.88,30.42
N$1
  Bottom 0.305: Q7.3 77.81,20.12 75.63,22.29 R41.2
N$2  (via drill 0.6)
  Top 0.305: CVD.4 48.58,13.78 44.97,17.4 44.97,32.89 45.73,33.66 51.57,33.66 52.46,34.55 52.46,41.4 53.22,42.17 v55.76,42.17
  Bottom 0.305: R17.2 61.92,42.17 IC5.1 v55.76,42.17
N$3  (via drill 0.6)
  Top 0.305: CVB.4 46.93,26.48 45.85,27.56 45.85,32.64 46.24,33.02 52.08,33.02 53.6,34.55 v60.33,34.55
  Bottom 0.305: IC5.7 v60.33,34.55 60.71,34.55 61.03,34.55 R20.2
N$4  (via drill 0.6)
  Top 0.305: CVC.4 40.33,13.78 44.2,17.65 44.2,33.4 45.35,34.55 v51.06,34.55
  Bottom 0.305: R26.2 50.43,35.18 v51.06,34.55 IC5.8
N$5  (via drill 0.6)
  Top 0.305: CVA.4 42.37,26.48 43.31,27.43 43.31,40.9 44.58,42.17 v51.19,42.17
  Bottom 0.305: R23.2 49.47,42.17 v51.19,42.17 IC5.14
N$6
  Bottom 0.305: Q13.3 65.24,12.34 63.44,10.54 R42.2
N$7
  Bottom 0.305: Q11.3 77.81,12.21 76.08,10.48 R43.2
N$8
  Bottom 0.305: Q10.B 57.07,21.17 R13.1
N$9
  Bottom 0.305: R36.1 138.38,6.74 138,7.11 134.88,7.11 132.73,9.26 Q3.3
  Bottom 0.61: Q1.1 138.5,5.59 R36.1
N$10
  Bottom 0.305: R14.1 69.79,23.14 Q8.B
N$11
  Bottom 0.305: R15.1 57.16,7.6 Q14.B
N$12
  Bottom 0.305: Q12.B 69.77,5.93 R16.1
N$13
  Bottom 0.305: 69.73,27.05 72.04,24.75 Q8.C
  Bottom 0.406: R44.1 69.73,27.05
N$14
  Bottom 0.305: 86.05,16.7 R31.1 85.1,15.62 85.1,13.46 85.47,13.09 Q6.3 | IC3.1 88.42,10.42 Q6.3 | Q6.3 85.59,13.09
N$15
  Bottom 0.305: R30.1 83.32,14.92 83.65,14.59 Q6.6 83.96,14.61 84.46,14.61 84.59,14.54 84.59,13.15 88.59,9.15 IC3.2
N$16
  Bottom 0.305: R32.1 89.42,15.28 Q5.6 90.12,14.61 90.62,14.61 90.75,14.48 90.75,12.89 92.08,11.56 92.08,8.38 91.57,7.88 IC3.3
N$17  (via drill 0.6)
  Top 0.305: v98.31,4.19 98.31,2.67 98.56,2.41 121.55,2.41 128.28,9.15 131.71,9.15 135.77,13.21 v138.18,13.21
  Bottom 0.305: IC4.11 v98.31,4.19 | R9.1 139.39,12.01 v138.18,13.21
N$18  (via drill 0.6)
  Top 0.305: v98.31,5.46 98.69,5.46 102.24,9.02 106.69,9.02 116.21,18.54 116.21,22.48 117.36,23.62 120.66,23.62 v122.05,25.02
  Bottom 0.305: IC4.12 v98.31,5.46 | v122.05,25.02 123.51,26.48 R10.1
N$19  (via drill 0.6)
  Top 0.305: v98.31,6.73 98.81,6.73 101.73,9.65 106.31,9.65 115.58,18.92 115.58,26.8 v114.69,27.69
  Bottom 0.305: IC4.13 v98.31,6.73 | 114.62,26.16 R11.1 v114.69,27.69
N$20
  Bottom 0.305: R8.2 107.38,12.83 GT9.4 106.56,13.66 C8.1
N$21
  Bottom 0.305: R37.1 125.8,10.55 126.04,10.78 Q3.6
  Bottom 0.61: Q2.1 R37.1
N$23
  Bottom 0.305: R7.2 GT10.4 C7.1
N$24
  Bottom 0.305: GT11.4 | GT11.4 C6.1 | R6.2 131.77,13.91 131.83,13.84 GT11.4
N$25
  Bottom 0.305: IC5.2 60.59,40.9 61.6,39.88 R18.2 62.81,40.45 63.76,41.4 63.76,41.85 R17.1
N$26
  Bottom 0.305: IC5.6 62.87,35.82 63.25,35.43 62.94,35.43 R19.2 62.81,35.24 64.08,33.98 R20.1
N$27
  Bottom 0.305: IC5.9 51.06,35.82 50.55,36.32 47.51,36.32 47.44,36.38 | R25.2 47.44,36.38 | R26.1 47.44,36.38
N$28
  Bottom 0.305: IC5.13 47.51,40.9 47.44,40.83 R24.2 R23.1
N$29
  Bottom 0.305: MIDI_IN.4 11.18,34.87 MIDI.4 23.64,39.95 R29.1
N$30
  Bottom 0.305: D1.A R29.2 25.47,36.7 IC7.2
N$31
  Bottom 0.305: MIDI.3 20.51,32.33 21.85,30.99 | 21.85,30.99 23.86,30.99 D1.C 24.24,31.37 24.39,31.37 25.41,32.39 25.41,33.15 26.42,34.16 IC7.3 | MIDI_IN.5 21.34,30.48 21.85,30.99
N$32
  Bottom 0.305: GT8.4 144.53,25.27 143.26,24 | 143.26,24 140.15,24 R5.2 | C1.1 143.58,23.68 143.26,24
N$33
  Bottom 0.305: GT5.4 | C4.1 105.48,25.53 GT5.4 | R12.2 106.17,26.22 GT5.4
N$34  (via drill 0.6)
  Top 0.305: v98.81,23.31 96.45,23.31 v94.81,24.95
  Bottom 0.305: v98.81,23.31 ICSP.5 | IC1.6 v94.81,24.95
N$35
  Bottom 0.305: R1.1 129.74,34.48 PWR.K
N$36
  Bottom 0.305: R3.1 116.91,34.61 ACT.K
N$37
  Bottom 0.305: R2.1 123.51,34.36 STA.K
N$38  (via drill 0.6)
  Top 0.305: v98.31,8 98.81,8 101.23,10.42 103.26,10.42 103.64,10.8 103.64,21.46 v102.12,22.67
  Bottom 0.305: IC4.14 v98.31,8 | v102.12,22.67 R12.1
N$39
  Bottom 0.305: R11.2 116.85,24.2 | 116.85,24.2 GT6.4 | C3.1 118.18,22.86 116.85,24.2
N$40
  Bottom 0.61: U$2.BARREL 132.94,42.55 103.39,42.55 102.62,41.78 D5.A
N$41
  Bottom 0.305: R10.2 129.93,24.58 | 129.93,24.58 GT7.4 | C2.1 130.88,23.62 129.93,24.58
N$42
  Bottom 0.305: R28.1 33.09,33.84 34.04,32.89 37.6,32.89 38.23,33.53 38.23,36.2 37.73,36.7 IC7.7
N$43  (via drill 0.6)
  Top 0.305: v138.18,16.51 131.39,9.72 127.96,9.72 121.29,3.05 99.7,3.05 v99.45,3.3
  Bottom 0.305: v99.45,3.3 99.45,3.05 99.58,2.92 IC4.7 | v138.18,16.51 138.37,16.7 138.31,26.42 138.5,26.61 R5.1
N$44  (via drill 0.6)
  Top 0.305: v99.45,4.7 100.46,3.68 118.56,3.62 121.04,3.62 127.83,10.42 128.79,10.42 129.29,10.92 129.29,15.11 v128.6,15.81
  Bottom 0.305: IC4.6 99.96,4.19 v99.45,4.7 | R6.1 v128.59,15.81 v128.6,15.81
N$45
  Bottom 0.305: IC4.5 103.26,5.46 103.64,5.08 103.64,3.43 104.02,3.05 114.18,3.05 114.69,3.56 R7.1
N$46
  Bottom 0.305: IC4.4 103.26,6.73 103.64,7.11 103.64,9.65 104.02,10.03 R8.1
N$48  (via drill 0.6)
  Top 0.305: v93.04,12.07 v101.35,12.07
  Bottom 0.305: Q5.3 91.5,13.09 91.26,13.34 91.26,15.62 R33.1 | Q5.3 92.2,13.09 | Q5.3 91.91,13.08 92.46,13.08 93.04,12.51 v93.04,12.07 | v101.35,12.07 101.67,11.75 IC4.1
N$49
  Bottom 0.305: R34.1 96.97,15.5 96.97,13.27 97.15,13.09 Q4.3 97.62,12.75 99.83,10.54 99.83,9.4 99.96,9.27 IC4.2
N$50
  Bottom 0.305: R35.1 95.26,15.15 Q4.6 | IC4.3 100.21,8 99.26,8.96 99.26,10.29 96.46,13.08 96.46,14.42 96.29,14.59 Q4.6 | 95.83,14.61 Q4.6
N$51
  Bottom 0.305: R45.1 56.97,10.73 57.03,10.67 58.36,10.67 59.32,9.72 59.32,8.59 Q14.C
N$52
  Bottom 0.305: R9.2 144.47,13.91 144.53,13.84 GT12.4 144.66,13.91 C5.1
N$53
  Bottom 0.305: Q9.3 65.17,20.05 63,22.23 63,22.67 R40.2
N$54
  Bottom 0.305: R46.1 69.73,11.75 71.97,9.51 Q12.C
N$55
  Bottom 0.305: 57.03,27.05 57.03,26.99 59.32,24.7 59.32,24.17
  Bottom 0.406: R47.1 57.03,27.05 | 59.32,24.17 Q10.C
N$57
  Bottom 0.305: IC1.7 93.5,24.3 93.92,23.88 95.77,23.88 ICSP.4
N$58  (via drill 0.6)
  Top 0.305: v98.81,25.85 96.34,25.85 95.96,26.23 v94.88,26.23
  Bottom 0.305: ICSP.1 v98.81,25.85 R4.2 | IC1.4 94.85,26.25 v94.88,26.23
SCL  (via drill 0.6)
  Top 0.305: v49.28,30.04 v69.6,30.04 72.78,30.04 73.22,29.59 81.8,29.59 87.76,23.62 90.05,23.62 v90.94,22.73
  Bottom 0.305: v69.6,30.04 R22.2 | IC2.P$13 50.43,31.18 v49.28,30.04 49.27,30.02 IC8.1 | IC1.9 91.2,23 v90.94,22.73
SDA  (via drill 0.6)
  Top 0.305: v47.25,29.08 v55.51,29.08 v72.14,29.08 81.48,29.08 87.83,22.73 v89.23,22.73
  Bottom 0.305: IC2.P$8 55.95,28.64 v55.51,29.08 | R21.2 v72.14,29.08 | IC8.3 46.31,28.14 v47.25,29.08 | IC1.8 90.14,23.65 v89.23,22.73
SR_CLK  (via drill 0.6)
  Top 0.305: v98.94,13.84 v93.04,13.84 91.45,13.84 87.01,18.29 v87.01,21.47
  Bottom 0.305: Q5.2 v93.04,13.84 | v98.94,13.84 Q4.2 | IC1.11 v87.01,21.47 v87,21.46
SR_DAT  (via drill 0.6)
  Top 0.305: v87.76,14.86 87.76,15.94 84.65,19.05 v84.65,23.05
  Bottom 0.305: Q6.2 86.75,13.84 v87.76,14.86 | IC1.13 85.25,23.65 v84.65,23.05
SR_DAT2  (via drill 0.6)
  Top 0.305: v94.56,12.96 91.45,12.96 91.45,13.02 85.67,18.8 v85.67,22.42
  Bottom 0.305: Q4.5 95.45,13.84 v94.56,12.96 | IC1.12 86.25,23 v85.67,22.42
SR_RCK  (via drill 0.6)
  Top 0.305: v82.87,13.84 86.75,13.84 | 86.75,13.84 v89.03,13.84 | v83.64,23.75 83.64,19.12 86.88,15.88 86.88,13.97 86.75,13.84
  Bottom 0.305: Q6.5 v82.87,13.84 | v89.03,13.84 Q5.5 | IC1.14 84.19,24.3 v83.64,23.75
STATUS_LED  (via drill 0.6)
  Top 0.305: STA.A 116.34,32.13 102.24,32.13 99.38,29.28 96.46,29.28 v94.88,27.69
  Bottom 0.305: IC1.3 94.09,26.9 v94.88,27.69
VDD_GT1  (via drill 0.6)
  Top 0.305: v66.24,13.46 66.24,16.38 | 66.24,16.38 v66.24,18.61 | 66.24,16.38 77.73,16.38 | v77.73,17.46 77.73,16.38 | 77.73,16.38 v77.73,15.18
  Top 0.61: v86.75,9.15 94.62,9.15 95.07,8.7 95.07,1.4 95.64,0.83 136.85,0.83 v137.42,1.4
  Bottom 0.305: C13.1 82.3,10.67 81.67,11.3 81.67,12.57 | 81.67,12.57 81.67,18.42 81.92,18.67 83.25,18.67 R30.2 R31.2 R32.2 | Q13.2 67.19,12.51 v66.24,13.46 | v66.24,18.61 66.29,18.61 Q9.2 | 81.67,12.57 81.61,12.51 Q11.2 78.94,12.51 78.81,12.64 78.81,14.99 78.62,15.18 v77.73,15.18 | 79.76,17.78 Q7.2 79.49,17.46 v77.73,17.46
  Bottom 0.61: IC3.15 IC3.16 82.36,10.42 C13.1 85.04,10.48 85.1,10.42 85.1,9.15 v86.75,9.15 | Q1.3 138.18,1.41 | 138.18,1.41 137.41,1.41 | D3.C 136.06,1.41 137.41,1.41 | 137.41,1.41 v137.42,1.4 138.17,1.4 138.18,1.41
VDD_GT2  (via drill 0.6)
  Top 0.305: v95,10.54 100.21,10.54 100.85,11.18 102.75,11.18 102.88,11.3 102.88,17.02 v101.35,18.54
  Top 0.61: v98.31,9.27 96.78,9.27 96.27,8.76 96.27,1.91 96.53,1.65 124.34,1.65 v124.59,1.91
  Bottom 0.305: R33.2 R35.2 | R35.2 R34.2 99.51,18.54 v101.35,18.54 | R35.2 96.97,18.6
  Bottom 0.61: C12.1 93.8,10.54 v95,10.54 IC4.16 IC4.15 v98.31,9.27 | Q2.3 126.33,1.83 D4.C 124.52,1.83 v124.59,1.91
VOUTA
  Bottom 0.305: IC2.P$3 56.33,31.82 55.89,32.26 55.89,39.24 56.27,39.63 IC5.3
VOUTB
  Bottom 0.305: IC2.P$2 56.84,32.45 56.52,32.77 56.52,36.7 56.9,37.09 IC5.5
VOUTC
  Bottom 0.305: IC2.P$6 57.22,29.91 55.25,31.62 55.25,39.24 54.87,39.63 IC5.12
VOUTD
  Bottom 0.305: IC2.P$7 56.97,29.28 54.62,31.37 54.62,36.7 54.24,37.09 IC5.10

### Text on the board
tNames: midi-to-cv | converter | rev 3 | POWER | hotchk155